# Altium schematic sheet Block_Diagram.SchDoc
size A4; CompanyName: Technische Hochschule Nürnberg Georg Simon Ohm; Organization: UltraZohm; Address1: Kesslerplatz 12; Address2: 90489 Nürnberg; Address3: GERMANY; DocumentNumber: 1; SheetNumber: 1; SheetTotal: 12; Website: www.ultrazohm.com
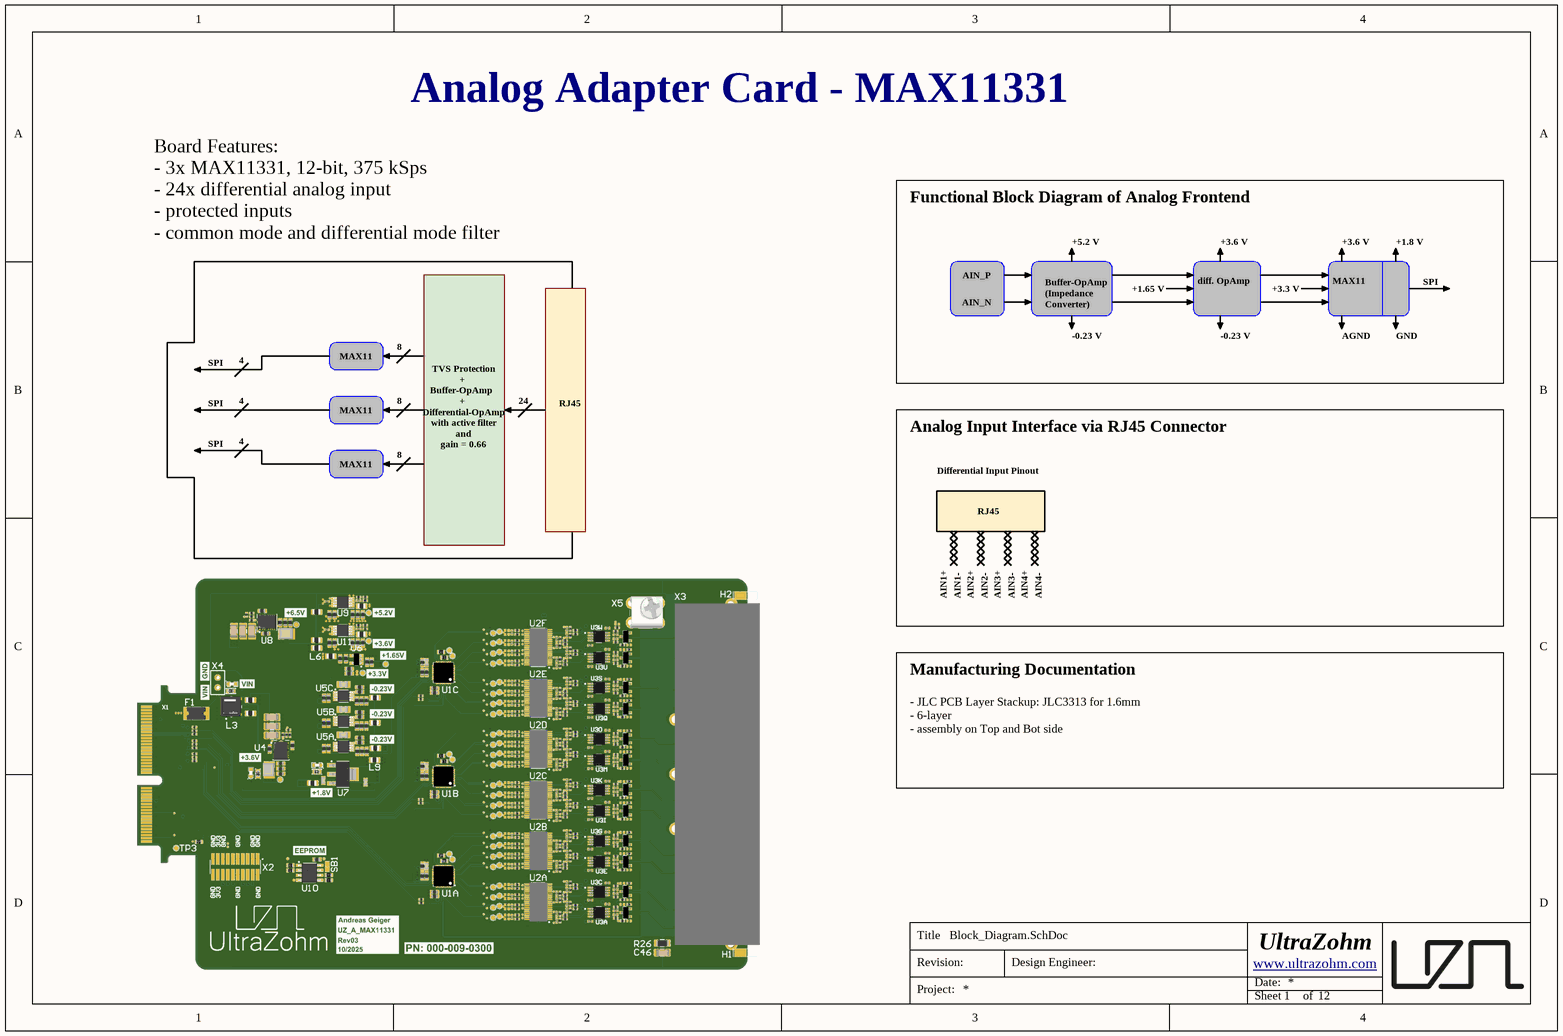
[diagram p0: Block_Diagram.SchDoc]

## Notes on the sheet
- Analog Adapter Card - MAX11331
- Functional Block Diagram of Analog Frontend
- +5.2 V
- +3.6 V
- +1.8 V
- AIN_P
- AIN_N
- Buffer-OpAmp
  (Impedance Converter)
- +1.65 V
- diff. OpAmp
- +3.3 V
- MAX11
- SPI
- Board Features:
  - 3x MAX11331, 12-bit, 375 kSps
  - 24x differential analog input
  - protected inputs
  - common mode and differential mode filter
- 4
- 8
- -0.23 V
- AGND
- GND
- 24
- RJ45
- Analog Input Interface via RJ45 Connector
- Differential Input Pinout
- TVS Protection
  +
  Buffer-OpAmp
  +
  Differential-OpAmp
  with active filter and
  gain = 0.66
- AIN1+
- AIN1-
- AIN2+
- AIN2-
- AIN3+
- AIN3-
- AIN4+
- AIN4-
- Manufacturing Documentation
- - JLC PCB Layer Stackup: JLC3313 for 1.6mm
  - 6-layer
  - assembly on Top and Bot side
- Title
- Revision:
- Design Engineer:
- Date:
- Project:
- Sheet
- of